# EAGLE design sensor_board2 (EAGLE 6.4)
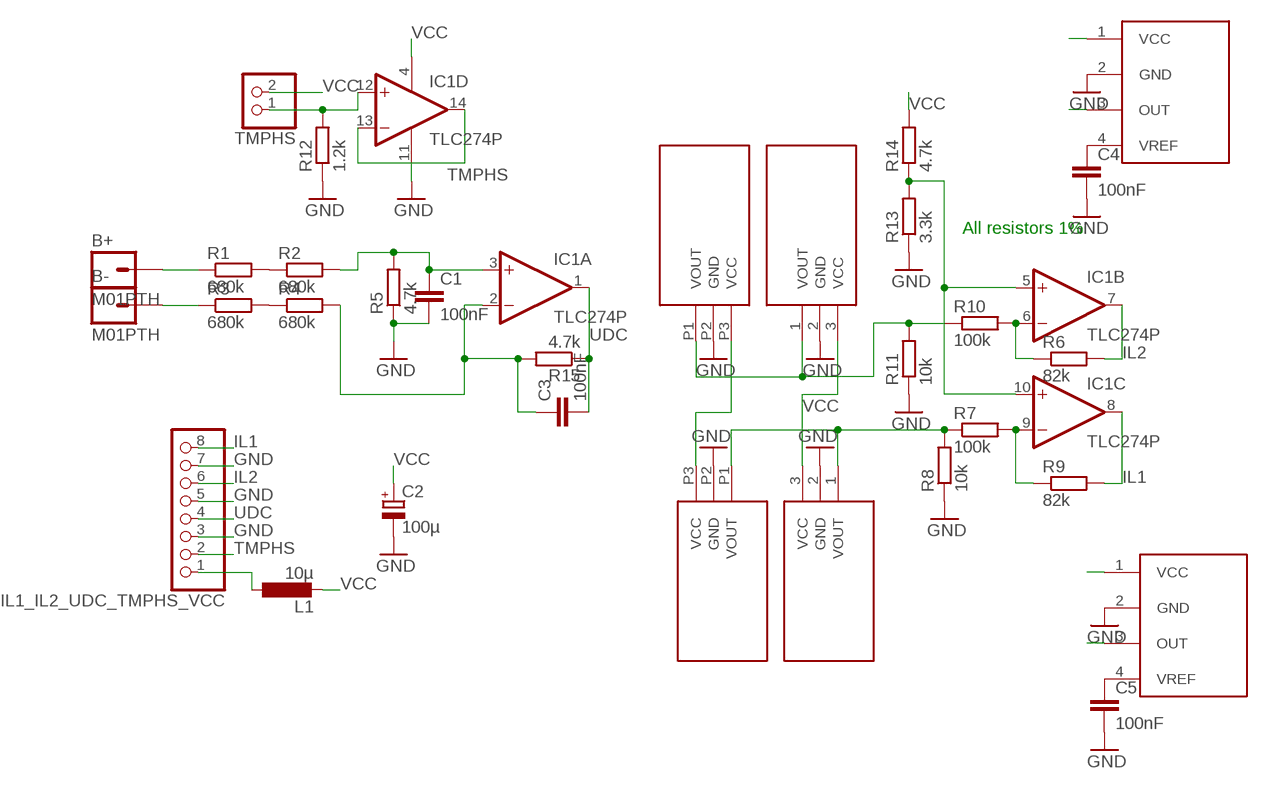
[diagram p0: schematic, sheet 1]

## Parts
B+  M01PTH  [1X01]
B-  M01PTH  [1X01]
C1  100nF  C-EU025-024X044  [C025-024X044]
C2  100µ  CPOL-EUE2,5-6E  [E2,5-6E]
C3  100nF  C-EU025-024X044  [C025-024X044]
C4  100nF  C-EU025-024X044  [C025-024X044]
C5  100nF  C-EU025-024X044  [C025-024X044]
IC1  TLC274P  [DIL14]
IL1_IL2_UDC_TMPHS_VCC  PINHD-1X8  [1X08]
L1  10µ  L-EU0207/12  [0207/12]
R1  680k  R-EU_0207/10  [0207/10]
R2  680k  R-EU_0207/10  [0207/10]
R3  680k  R-EU_0207/10  [0207/10]
R4  680k  R-EU_0207/10  [0207/10]
R5  4.7k  R-EU_0207/10  [0207/10]
R6  82k  R-EU_0207/10  [0207/10]
R7  100k  R-EU_0207/10  [0207/10]
R8  10k  R-EU_0207/10  [0207/10]
R9  82k  R-EU_0207/10  [0207/10]
R10  100k  R-EU_0207/10  [0207/10]
R11  10k  R-EU_0207/10  [0207/10]
R12  1.2k  R-EU_0207/10  [0207/10]
R13  3.3k  R-EU_0207/10  [0207/10]
R14  4.7k  R-EU_0207/10  [0207/10]
R15  4.7k  R-EU_0207/10  [0207/10]
TMPHS  PINHD-1X2  [1X02]
U$1  TAMURA_L01Z_S05  [TAMURA_L01Z_S05]
U$2  TAMURA_L01Z_S05  [TAMURA_L01Z_S05]
U$3  HTFS  [HTFS]
U$4  HTFS  [HTFS]
U$5  TAMURA_L06P_S05L06P  [TAMURA_L06P_S05]
U$6  TAMURA_L06P_S05L06P  [TAMURA_L06P_S05]

## Nets
GND: C1.2 C2.- C4.2 C5.2 IC1.11(P:V-) IL1_IL2_UDC_TMPHS_VCC.3 IL1_IL2_UDC_TMPHS_VCC.5 IL1_IL2_UDC_TMPHS_VCC.7 R5.1 R8.1 R11.1 R12.1 R13.1 U$1.2(GND) U$2.2(GND) U$3.2(GND) U$4.2(GND) U$5.P2(GND) U$6.P2(GND)
IL1: IC1.8(C:OUT) IL1_IL2_UDC_TMPHS_VCC.8 R9.2
IL2: IC1.7(B:OUT) IL1_IL2_UDC_TMPHS_VCC.6 R6.2
N$1: R1.2 R2.1
N$2: R3.2 R4.1
N$3: IC1.5(B:+IN) IC1.10(C:+IN) R13.2 R14.1
N$4: C1.1 IC1.3(A:+IN) R2.2 R5.2
N$5: B+.1 R1.1
N$6: B-.1 R3.1
N$7: IL1_IL2_UDC_TMPHS_VCC.1 L1.1
N$8: IC1.9(C:-IN) R7.2 R9.1
N$9: IC1.6(B:-IN) R6.1 R10.2
N$10: C3.1 IC1.2(A:-IN) R4.2 R15.2
N$11: C4.1 U$3.4(VREF)
N$12: C5.1 U$4.4(VREF)
N$16: IC1.12(D:+IN) R12.2 TMPHS.1
TMPHS: IC1.13(D:-IN) IC1.14(D:OUT) IL1_IL2_UDC_TMPHS_VCC.2
UDC: C3.2 IC1.1(A:OUT) IL1_IL2_UDC_TMPHS_VCC.4 R15.1
VCC: C2.+ IC1.4(P:V+) L1.2 R14.2 TMPHS.2 U$1.3(VCC) U$2.3(VCC) U$3.1(VCC) U$4.1(VCC) U$5.P3(VCC) U$6.P3(VCC)
VOUT1: R7.1 R8.2 U$2.1(VOUT) U$4.3(OUT) U$6.P1(VOUT)
VOUT2: R10.1 R11.2 U$1.1(VOUT) U$3.3(OUT) U$5.P1(VOUT)

## Notes on the sheet
- All resistors 1%

## Library data of the parts
B+ B- = SparkFun-Connectors:M01: Header 1 Standard 1-pin 0.1" header. Use with straight break away headers (SKU : PRT-00116), right angle break away headers (PRT-00553), swiss pins (PRT-00743), machine pins (PRT-00117), and female headers (PRT-00115).
C1 C3-C5 = rcl:C-EU: CAPACITOR, European symbol
C2 = rcl:CPOL-EU: POLARIZED CAPACITOR, European symbol
IC1 = linear:TLC274: OP AMP
IL1_IL2_UDC_TMPHS_VCC = pinhead:PINHD-1X8: PIN HEADER
L1 = rcl:L-EU: INDUCTOR, European symbol
R1-R15 = rcl:R-EU_: RESISTOR, European symbol
TMPHS = pinhead:PINHD-1X2: PIN HEADER
U$1 U$2 = current sensor:TAMURA_L01Z_S05
U$3 U$4 = lem:HTFS
U$5 U$6 = current sensor:TAMURA_L06P_S05

## Board
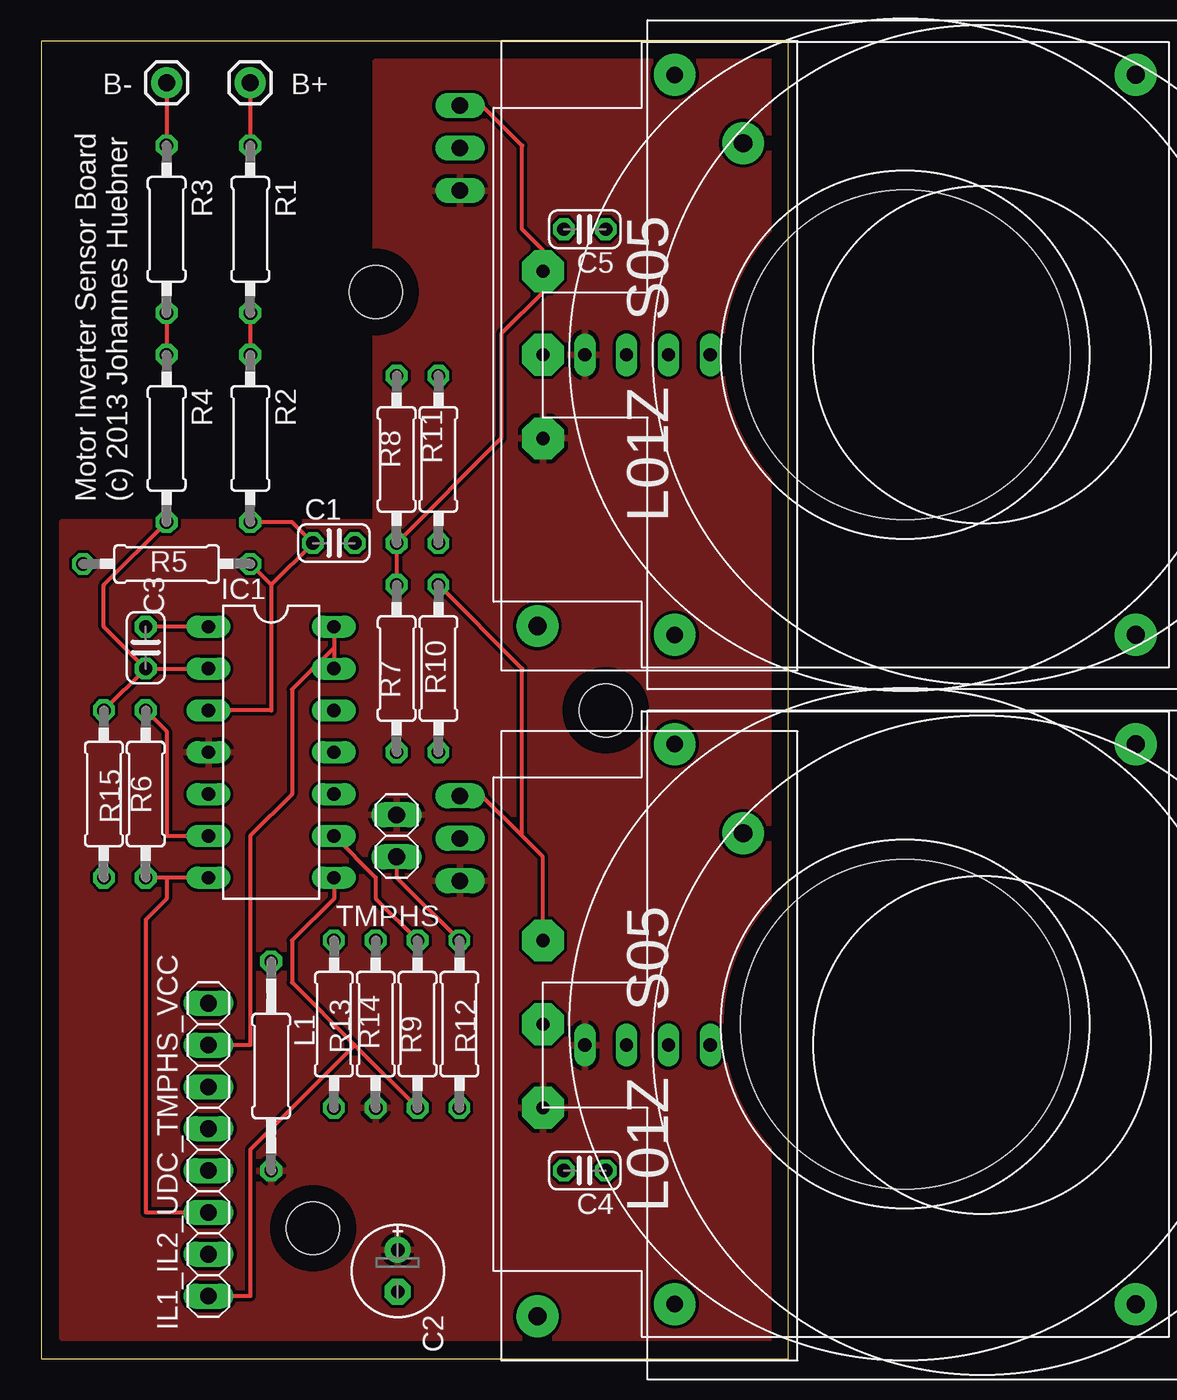
[diagram p1: board, top side]
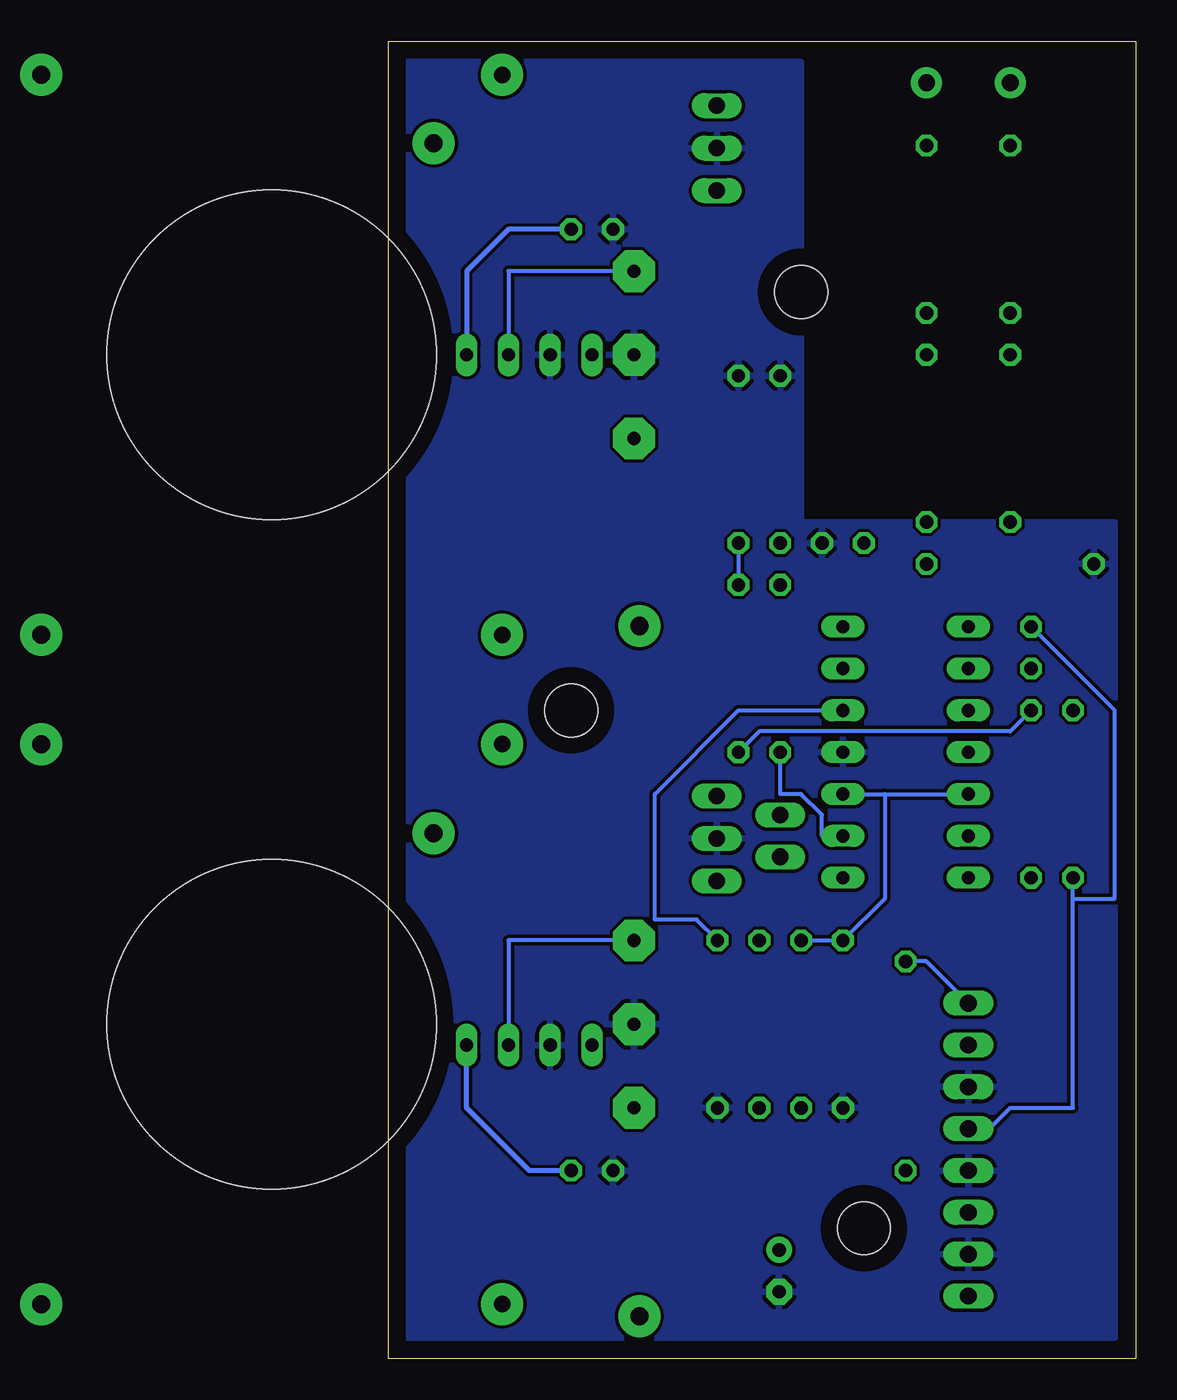
[diagram p2: board, bottom side, seen from below]

Size 45.39 x 80 mm. Coordinates in mm from the lower left corner, seen from the top.
Outline: 0,0 45.39,0 45.39,80 0,80 0,0
Copper layers (1*16): Top 0.035mm / dielectric 1.5mm / Bottom 0.035mm
Design rules "default": minimum track width 10mil, minimum drill 24mil, track to track 8mil, track to pad 8mil, pad to pad 8mil, via to via 8mil, smd to smd 8mil, copper to edge 40mil, drill to drill 8mil, minimum pad ring 10mil, minimum via ring 8mil, stop-mask expansion 4mil, vias tented up to drill 0mil, thermal gap 10mil
Holes 3.2 mm at 16.51,7.93 20.32,64.77 34.29,39.37

### Footprints (pad centres in the part's own frame; a part is rotated, then mirrored left to right if it is on the bottom)
1X01 = drill 1.016 pad 1.88: 1 0,0
C025-024X044 = drill 0.813 octagon: 1 -1.27,0; 2 1.27,0
E2,5-6E = drill 0.813 pad 1.575: + -1.27,0 | drill 0.813 pad 1.575 octagon: - 1.27,0
DIL14 = drill 0.813 long: 1 -7.62,-3.81; 2 -5.08,-3.81; 3 -2.54,-3.81; 4 0,-3.81; 5 2.54,-3.81; 6 5.08,-3.81; 7 7.62,-3.81; 8 7.62,3.81; 9 5.08,3.81; 10 2.54,3.81; 11 0,3.81; 12 -2.54,3.81; 13 -5.08,3.81; 14 -7.62,3.81
1X08 = drill 1.016 long: 1 -8.89,0; 2 -6.35,0; 3 -3.81,0; 4 -1.27,0; 5 1.27,0; 6 3.81,0; 7 6.35,0; 8 8.89,0
0207/12 = drill 0.813 octagon: 1 -6.35,0; 2 6.35,0
0207/10 = drill 0.813 octagon: 1 -5.08,0; 2 5.08,0
1X02 = drill 1.016 long: 1 -1.27,0; 2 1.27,0
TAMURA_L01Z_S05 = drill 1 long: 1 -3.92,2.5; 2 -6.5,2.5; 3 -9.08,2.5 | drill 1.1 pad 2.54: P$4 -6.2,-14.7; P$5 -35.52,-2.2
HTFS = drill 0.8 long: 1 0,24.13; 2 0,21.59; 3 0,19.05; 4 0,16.51
TAMURA_L06P_S05 = drill 0.8 pad 2.54 octagon: P1 5.08,0; P2 0,0; P3 -5.08,0 | drill 1 pad 2.54: P$4 -17,-8; P$5 17,-8 | drill 1.1 pad 2.54: P$6 -17,-36; P$7 17,-36 | hole 20: 0,-22

### Placement (x,y rotation side)
B+  12.7,77.47 0 top
B-  7.62,77.47 0 top
C1  17.78,49.53 0 top
C2  21.65,5.34 270 top
C3  6.35,43.18 90 top
C4  33.02,11.43 180 top
C5  33.02,68.58 180 top
IC1  13.97,36.83 270 top
IL1_IL2_UDC_TMPHS_VCC  10.16,12.7 270 top
L1  13.97,17.78 270 top
R1  12.7,68.58 270 top
R2  12.7,55.88 270 top
R3  7.62,68.58 270 top
R4  7.62,55.88 270 top
R5  7.62,48.26 0 top
R6  6.35,34.29 270 top
R7  21.59,41.91 270 top
R8  21.59,54.61 270 top
R9  22.86,20.32 270 top
R10  24.13,41.91 270 top
R11  24.13,54.61 270 top
R12  25.4,20.32 90 top
R13  17.78,20.32 90 top
R14  20.32,20.32 270 top
R15  3.81,34.29 90 top
TMPHS  21.59,31.75 90 top
U$1  27.94,38.1 90 top
U$2  27.94,80.01 90 top
U$3  57.15,19.05 90 top
U$4  57.15,60.96 90 top
U$5  30.48,20.32 90 top
U$6  30.48,60.96 90 top

### Tracks (layer width: path | path; a pad name or v marks a point on that pad's centre or on a via)
GND
  pour Bottom: 1.27,50.8 20.32,50.8 20.32,78.74 44.45,78.74 44.45,1.27 1.27,1.27
IL1
  Top 0.254: 19.05,19.05 15.24,22.86 15.24,25.4 17.78,27.94 IC1.8 | 19.05,19.05 R9.2 | IL1_IL2_UDC_TMPHS_VCC.8 12.7,3.81 12.7,12.7 19.05,19.05
IL2
  Top 0.254: IC1.7 7.62,29.21 | 7.62,29.21 R6.2 | IL1_IL2_UDC_TMPHS_VCC.6 6.35,8.89 6.35,26.67 7.62,27.94 7.62,29.21
N$1
  Top 0.254: R1.2 R2.1
N$2
  Top 0.254: R3.2 R4.1
N$3
  Bottom 0.254: R14.1 R13.2 15.24,27.94 15.24,34.29 | IC1.10 15.24,34.29 | 15.24,34.29 IC1.5
N$4
  Top 0.254: R2.2 15.24,50.8 C1.1 13.97,46.99 | IC1.3 13.97,39.37 13.97,46.99 | R5.2 13.97,46.99
N$5
  Top 0.254: B+.1 R1.1
N$6
  Top 0.254: B-.1 R3.1
N$7
  Bottom 0.254: IL1_IL2_UDC_TMPHS_VCC.1 12.7,24.13 L1.1
N$8
  Top 0.254: R9.1 20.32,27.94 20.32,29.21 IC1.9
  Bottom 0.254: R7.2 21.59,34.29 20.32,34.29 19.05,33.02 19.05,31.75 IC1.9
N$9
  Top 0.254: IC1.6 7.62,31.75 7.62,38.1 R6.1
  Bottom 0.254: R10.2 22.86,38.1 7.62,38.1 R6.1
N$10
  Top 0.254: C3.1 R15.2 | C3.1 IC1.2 | R4.2 3.81,46.99 3.81,44.45 C3.1
N$11
  Bottom 0.305: C4.1 36.83,11.43 40.64,15.24 U$3.4
N$12
  Bottom 0.305: C5.1 38.1,68.58 40.64,66.04 U$4.4
N$16
  Top 0.254: R12.2 21.59,29.21 TMPHS.1
  Bottom 0.254: IC1.12 24.13,39.37 29.21,34.29 29.21,26.67 26.67,26.67 R12.2
TMPHS
  Top 0.254: IC1.14 17.78,43.18 | 17.78,43.18 IC1.13 | IL1_IL2_UDC_TMPHS_VCC.2 12.7,19.05 12.7,31.75 15.24,34.29 15.24,40.64 17.78,43.18
UDC
  Top 0.254: IC1.1 C3.2
  Bottom 0.254: 3.81,27.94 3.81,15.24 7.62,15.24 8.89,13.97 IL1_IL2_UDC_TMPHS_VCC.4 | 3.81,27.94 R15.1 | C3.2 1.27,39.37 1.27,27.94 3.81,27.94
VCC
  pour Top: 1.27,50.8 20.32,50.8 20.32,78.74 44.45,78.74 44.45,1.27 1.27,1.27
VOUT1
  Top 0.254: R7.1 R8.2 27.94,55.88 27.94,62.23 30.48,64.77 U$6.P1 30.48,67.31 29.21,68.58 29.21,73.66 26.67,76.2 U$2.1
  Bottom 0.254: U$4.3 38.1,66.04 U$6.P1
VOUT2
  Top 0.254: 29.21,31.75 30.48,30.48 U$5.P1 | 29.21,31.75 26.67,34.29 U$1.1 | R10.1 29.21,41.91 29.21,31.75
  Bottom 0.254: R11.2 R10.1 | U$3.3 38.1,25.4 U$5.P1

### Text on the board
tNames: Motor Inverter Sensor Board / (c) 2013 Johannes Huebner